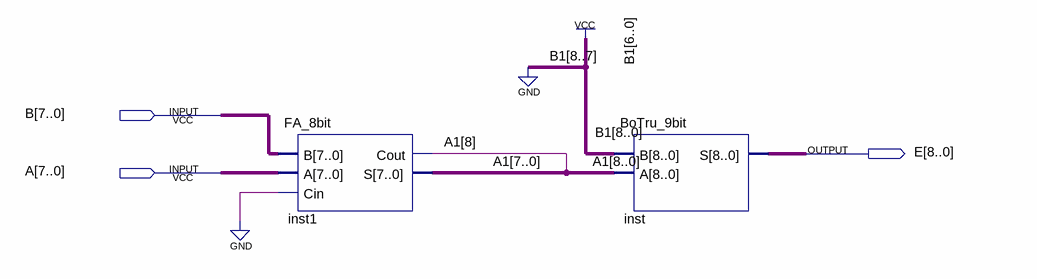
[diagram p0: schematic sheet]
// Quartus schematic E_Nhan.bdf as structural Verilog: 2 symbols, 3 pins
module E_Nhan (
  input  [7:0] B,
  input  [7:0] A,
  output [8:0] E
);

  wire [8:0] A1;

  FA_8bit inst1 (.B(B), .A(A), .Cin(1'b0), .Cout(A1[8]), .S(A1[7:0]));
  BoTru_9bit inst (.B(9'b001111111), .A(A1), .S(E));
endmodule
